# EAGLE design pectus (EAGLE 6.4)

## Sheet 1 of 2
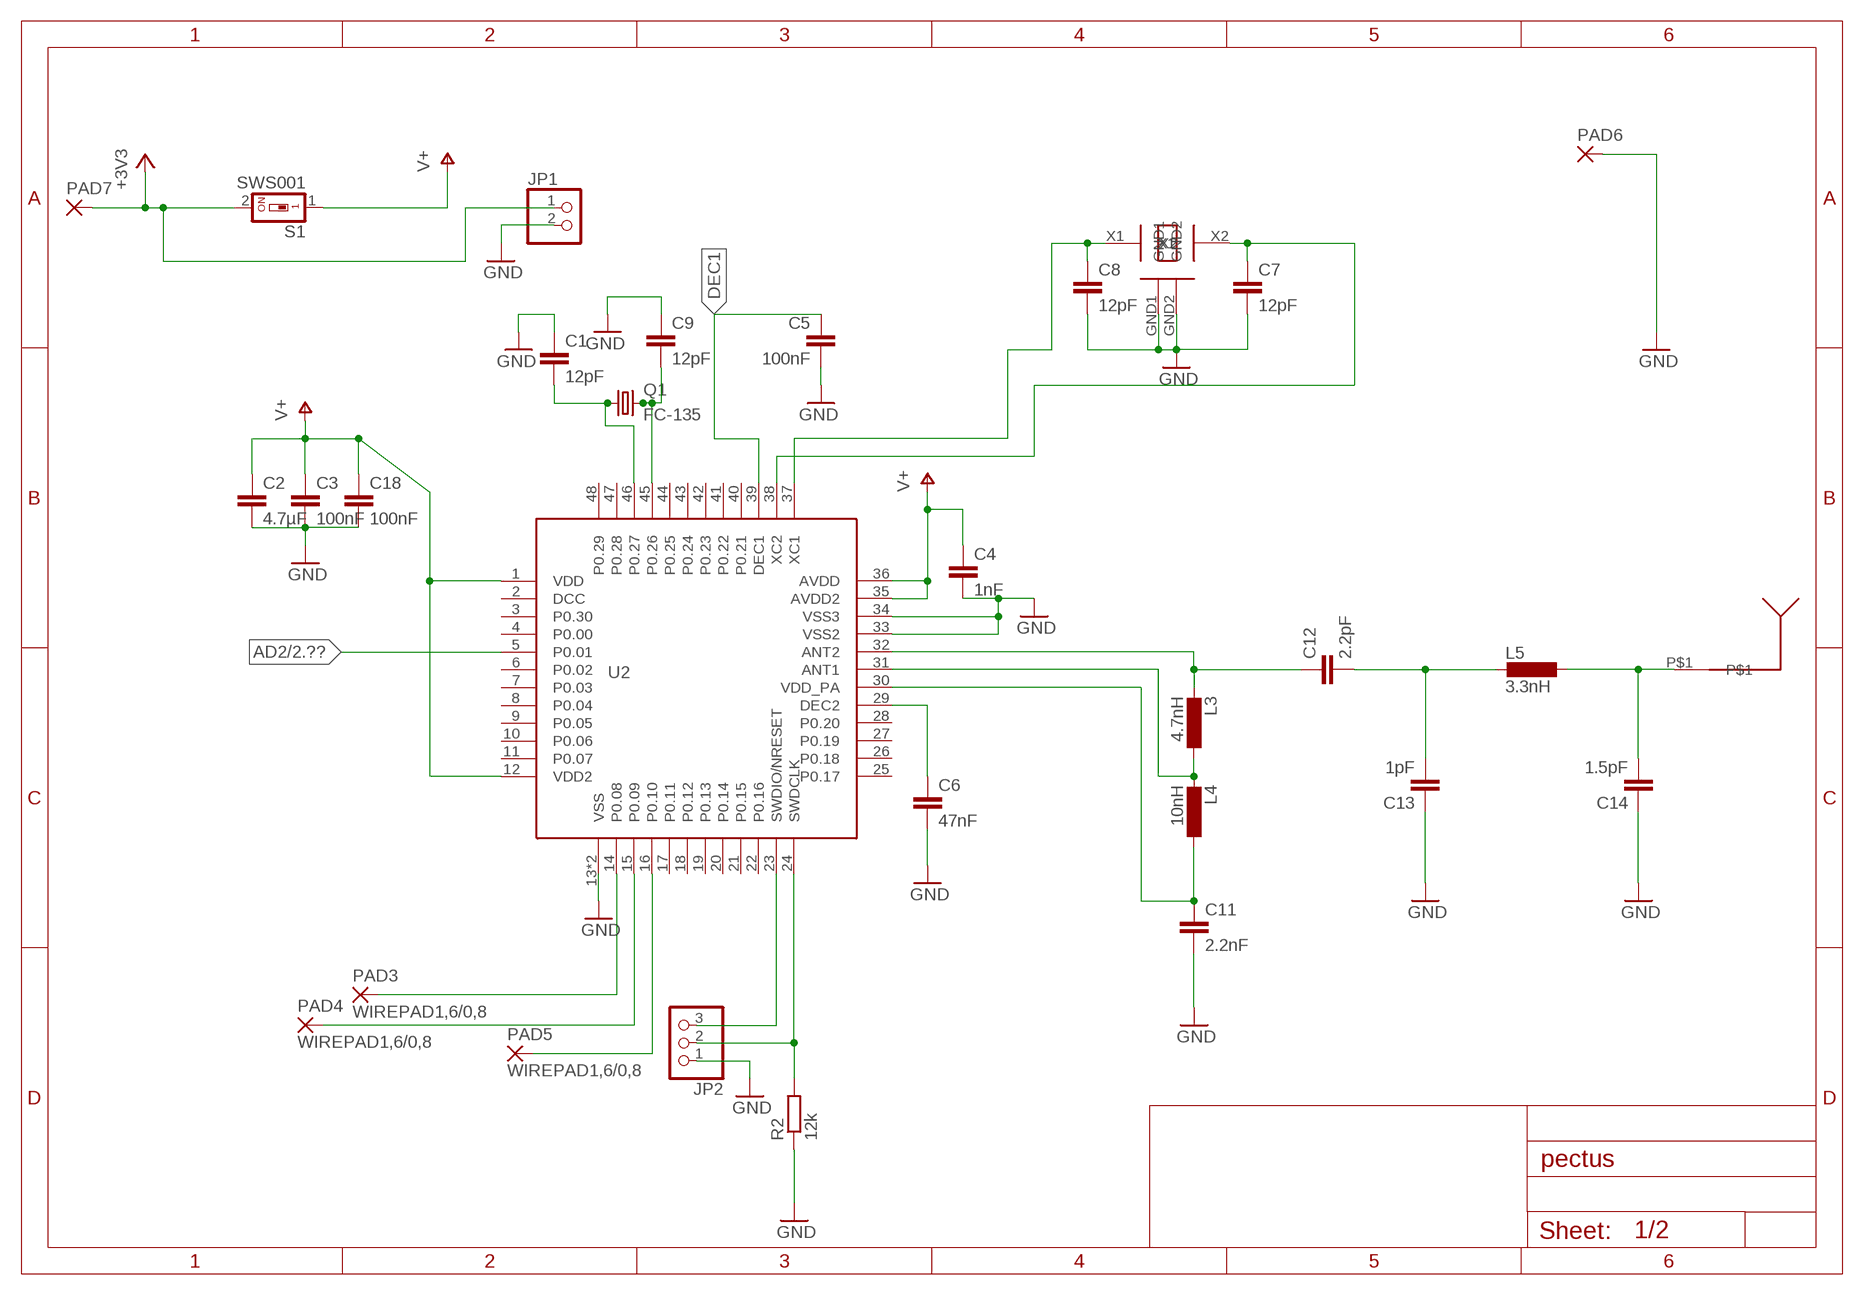
[diagram p0: schematic, sheet 1]

### Parts
C1  12pF  C-EUC0603K  [C0603K]
C2  4.7µF  C-EUC0603K  [C0603K]
C3  100nF  C-EUC0603K  [C0603K]
C4  1nF  C-EUC0603K  [C0603K]
C5  100nF  C-EUC0603K  [C0603K]
C6  47nF  C-EUC0603K  [C0603K]
C7  12pF  C-EUC0603K  [C0603K]
C8  12pF  C-EUC0603K  [C0603K]
C9  12pF  C-EUC0603K  [C0603K]
C11  2.2nF  C-EUC0603  [C0603]
C12  2.2pF  C-EUC0603  [C0603]
C13  1pF  C-EUC0603  [C0603]
C14  1.5pF  C-EUC0603  [C0603]
C18  100nF  C-EUC0603K  [C0603K]
JP1  PINHD-1X2  [1X02]
JP2  PINHD-1X3  [1X03]
L3  4.7nH  L-EUL0603  [R0603]
L4  10nH  L-EUL0603  [R0603]
L5  3.3nH  L-EUL0603  [R0603]
PAD3  WIREPAD1,6/0,8  [1,6/0,8]
PAD4  WIREPAD1,6/0,8  [1,6/0,8]
PAD5  WIREPAD1,6/0,8  [1,6/0,8]
PAD6  SMD5  [SMD2,54-5,08]
PAD7  SMD5  [SMD2,54-5,08]
Q1  FC-135  [FC-135]
R2  12k  R-EU_R0402  [R0402]
S1  SWS001  [SMS-001]
U2  NRF51822QFN  [QFN48(6X6)]
U$2  AVX16MHZOSCILLATOR  [AVX16MHZOSCILLATOR]
U$4  ANTENNA  [ANTENNA]

### Nets
+3V3: JP1.1 PAD7.1(P) S1.2
AD2: U2.5(P0.01) ; also sheet 2
DEC1: C5.1 U2.39(DEC1)
GND: C1.1 C2.2 C3.2 C4.2 C5.2 C6.2 C7.2 C8.2 C9.1 C11.2 C13.1 C14.1 C18.2 JP1.2 JP2.1 PAD6.1(P) R2.1 U2.13(VSS) U2.33(VSS2) U2.34(VSS3) U2.P$49(VSS) U$2.GND1 U$2.GND2 ; also sheet 2
N$1: C9.2 Q1.P$2 U2.45(P0.26)
N$2: C1.2 Q1.P$1 U2.46(P0.27)
N$3: PAD3.1(P) U2.14(P0.08)
N$4: PAD4.1(P) U2.15(P0.09)
N$5: PAD5.1(P) U2.16(P0.10)
N$7: C6.1 U2.29(DEC2)
N$8: JP2.3 U2.23(SWDIO/NRESET)
N$9: JP2.2 R2.2 U2.24(SWDCLK)
N$10: C8.1 U2.37(XC1) U$2.X1
N$11: C7.1 U2.38(XC2) U$2.X2
N$22: C11.1 L4.1 U2.30(VDD_PA)
N$23: L3.1 L4.2 U2.31(ANT1)
N$24: C12.1 L3.2 U2.32(ANT2)
N$25: C12.2 C13.2 L5.2
N$28: C14.2 L5.1 U$4.P$1
V+: C2.1 C3.1 C4.1 C18.1 S1.1 U2.1(VDD) U2.12(VDD2) U2.35(AVDD2) U2.36(AVDD) ; also sheet 2
Unconnected: U2.2(DCC) U2.3(P0.30) U2.4(P0.00) U2.6(P0.02) U2.7(P0.03) U2.8(P0.04) U2.9(P0.05) U2.10(P0.06) U2.11(P0.07) U2.17(P0.11) U2.18(P0.12) U2.19(P0.13) U2.20(P0.14) U2.21(P0.15) U2.22(P0.16) U2.25(P0.17) U2.26(P0.18) U2.27(P0.19) U2.28(P0.20) U2.40(P0.21) U2.41(P0.22) U2.42(P0.23) U2.43(P0.24) U2.44(P0.25) U2.47(P0.28) U2.48(P0.29)

## Sheet 2 of 2
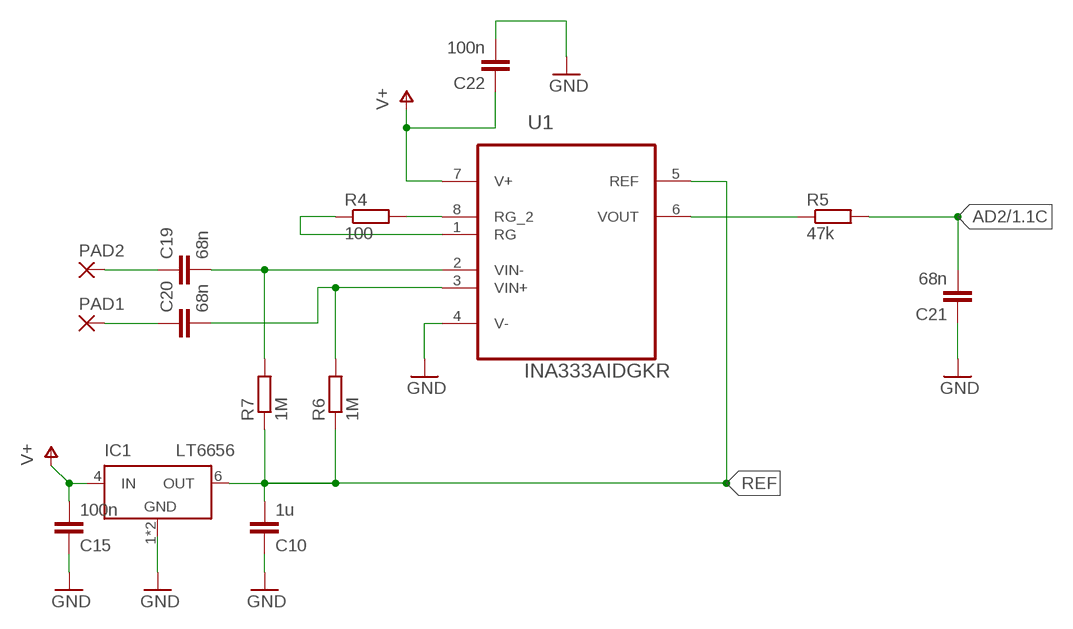
[diagram p1: schematic, sheet 2]

### Parts
C10  1u  C-EUC0603  [C0603]
C15  100n  C-EUC0603  [C0603]
C19  68n  C-EUC0603  [C0603]
C20  68n  C-EUC0603  [C0603]
C21  68n  C-EUC0603  [C0603]
C22  100n  C-EUC0603  [C0603]
IC1  LT6656  [TSOT23-6]
PAD1  1,6/0,8  [1,6/0,8]
PAD2  1,6/0,8  [1,6/0,8]
R4  100  R-EU_R0603  [R0603]
R5  47k  R-EU_R0603  [R0603]
R6  1M  R-EU_R0603  [R0603]
R7  1M  R-EU_R0603  [R0603]
U1  INA333AIDGKR  [SOP65P490X110-8N]

### Nets
AD2: C21.2 R5.2 ; also sheet 1
GND: C10.1 C15.1 C21.1 C22.2 IC1.1(GND) IC1.2(GND) U1.4(V-) ; also sheet 1
N$21: C19.1 PAD2.1(P)
N$26: R4.2 U1.8(RG_2)
N$27: C20.1 PAD1.1(P)
N$29: R4.1 U1.1(RG)
N$30: R5.1 U1.6(VOUT)
N$32: C19.2 R7.2 U1.2(VIN-)
N$33: C20.2 R6.2 U1.3(VIN+)
REF: C10.2 IC1.6(OUT) R6.1 R7.1 U1.5(REF)
V+: C15.2 C22.1 IC1.4(IN) U1.7(V+) ; also sheet 1

## Library data of the parts
C1-C15 C18-C22 = rcl:C-EU: CAPACITOR, European symbol
IC1 = LT6656:LT6656
JP1 = pinhead:PINHD-1X2: PIN HEADER
JP2 = pinhead:PINHD-1X3: PIN HEADER
L3-L5 = rcl2:L-EU: INDUCTOR, European symbol
PAD1 PAD2 = wirepad:1,6/0,8: THROUGH-HOLE PAD
PAD3-PAD5 = wirepad:WIREPAD: Wire PAD connect wire on PCB
PAD6 PAD7 = wirepad:SMD5: SMD PAD
Q1 = FC135:FC-135
R2 R4-R7 = rcl:R-EU_: RESISTOR, European symbol
S1 = smd-special:SWS001: SMD Dip Switch 1 pol.
U1 = Ina333:INA333AIDGKR: 0.05ìV/°C max, SINGLE-SUPPLY CMOS OPERATIONAL AMPLIFIERS Zer.-Drift Series; MPN: INA333AIDGKR; OC_FARNELL: 2295977; OC_NEWARK: 01P0907; PACKAGE: MSOP-8; SUPPLIER: Texas Instruments
U2 = nRF51822qfn:NRF51822QFN
U$2 = crystal:AVX16MHZOSCILLATOR
U$4 = nordicsemi:ANTENNA

## Board
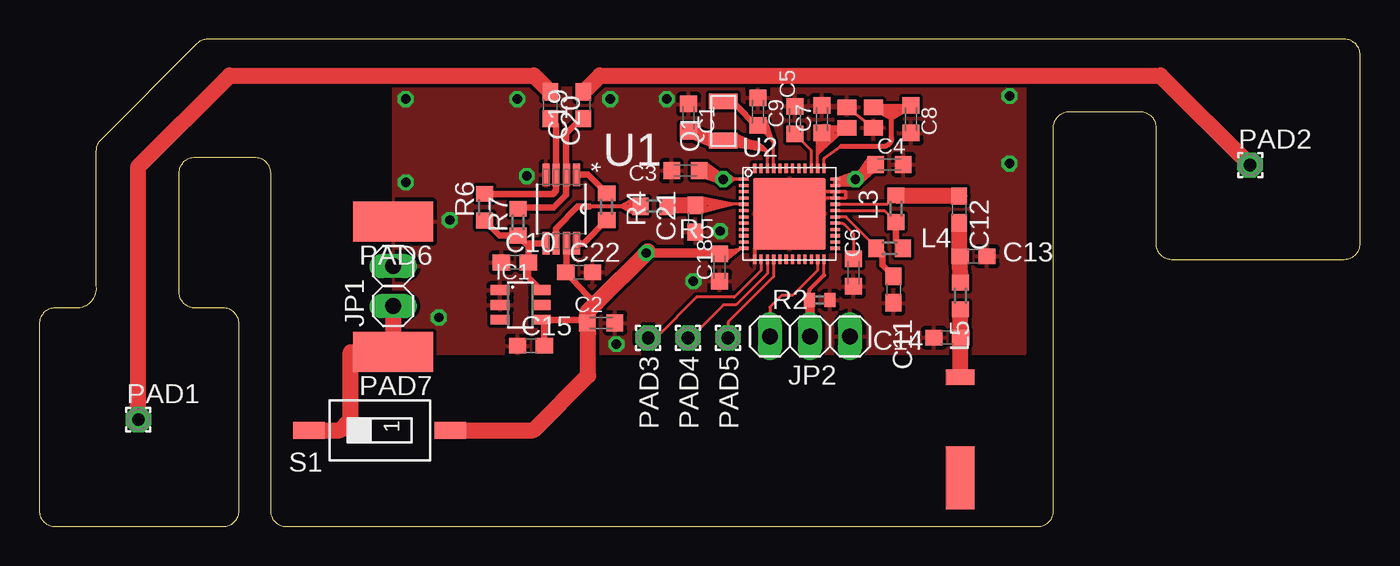
[diagram p2: board, top side]
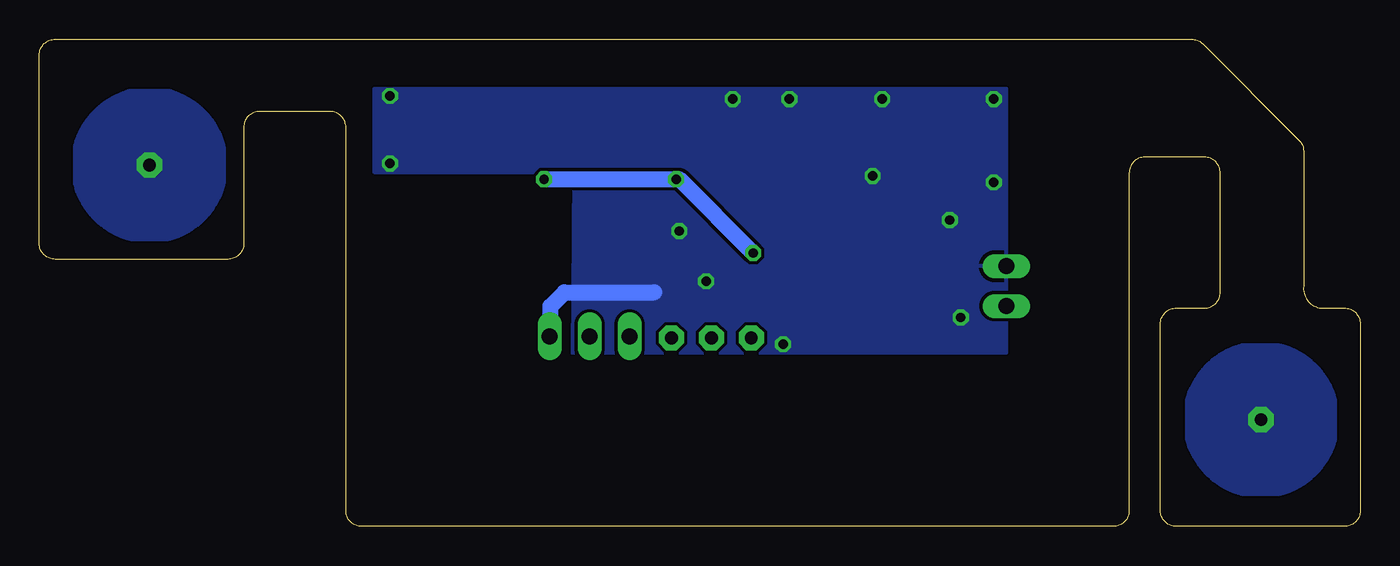
[diagram p3: board, bottom side, seen from below]

Size 84 x 31 mm. Coordinates in mm from the lower left corner, seen from the top.
Outline: 15.7,0 63.5,0 arc90 64.5,1 64.5,25.4 arc-90 65.5,26.4 70,26.4 arc-90 71,25.4 71,18 arc90 72,17 83,17 arc90 84,18 84,30 arc90 83,31 10.71,31 arc45 10.01,30.71 3.89,24.59 arc45 3.6,23.89 3.6,15.3 arc-90 2.5,13.9 1,13.9 arc90 0,12.9 0,1 arc90 1,0 11.7,0 arc90 12.7,1 12.7,12.9 arc90 11.7,13.9 9.9,13.9 arc-90 8.9,14.9 8.9,22.5 arc-90 9.9,23.5 13.7,23.5 arc-90 14.7,22.5 14.7,1 arc90 15.7,0
Copper layers (1*16): Top 0.035mm / dielectric 1.5mm / Bottom 0.035mm
Design rules "default *": minimum track width 0.15mm, minimum drill 0.6mm, track to track 0.2mm, track to pad 0.2mm, pad to pad 0.2mm, via to via 0.2mm, smd to smd 0.2mm, copper to edge 40mil, drill to drill 8mil, minimum pad ring 10mil, minimum via ring 8mil, stop-mask expansion 4mil, vias tented up to drill 0.6mm, thermal gap 10mil

### Footprints (pad centres in the part's own frame; a part is rotated, then mirrored left to right if it is on the bottom)
C0603K = smd 1.05 x 1.08: 1 -0.875,0; 2 0.875,0
C0603 = smd 1.1 x 1: 1 -0.85,0; 2 0.85,0
TSOT23-6 = smd 0.62 x 1.22: 1 -0.95,-1.3; 2 0,-1.3; 3 0.95,-1.3; 4 0.95,1.3; 5 0,1.3; 6 -0.95,1.3
1X02 = drill 1.016 long: 1 -1.27,0; 2 1.27,0
1X03 = drill 1.016 long: 1 -2.54,0; 2 0,0; 3 2.54,0
R0603 = smd 1 x 1.1: 1 -0.85,0; 2 0.85,0
1,6/0,8 = drill 0.813 pad 1.6 octagon: 1 0,0
SMD2,54-5,08 = smd 2.54 x 5.08: 1 0,0
FC-135 = smd 1 x 1.8: P$1 -1.25,0; P$2 1.25,0
R0402 = smd 0.7 x 0.9: 1 -0.65,0; 2 0.65,0
SMS-001 = smd 1.092 x 2.007: 1 0,-4.496; 2 0,4.496
SOP65P490X110-8N = smd 1.422 x 0.432: 1 -2.184,0.965; 2 -2.184,0.33; 3 -2.184,-0.33; 4 -2.184,-0.965; 5 2.184,-0.965; 6 2.184,-0.33; 7 2.184,0.33; 8 2.184,0.965
QFN48(6X6) = smd 0.6 x 0.2: 1 -2.9,2.2; 2 -2.9,1.8; 3 -2.9,1.4; 4 -2.9,1; 5 -2.9,0.6; 6 -2.9,0.2; 7 -2.9,-0.2; 8 -2.9,-0.6; 9 -2.9,-1; 10 -2.9,-1.4; 11 -2.9,-1.8; 12 -2.9,-2.2; 25 2.9,-2.2; 26 2.9,-1.8; 27 2.9,-1.4; 28 2.9,-1; 29 2.9,-0.6; 30 2.9,-0.2; 31 2.9,0.2; 32 2.9,0.6; 33 2.9,1; 34 2.9,1.4; 35 2.9,1.8; 36 2.9,2.2 | smd 0.2 x 0.6: 13 -2.2,-2.9; 14 -1.8,-2.9; 15 -1.4,-2.9; 16 -1,-2.9; 17 -0.6,-2.9; 18 -0.2,-2.9; 19 0.2,-2.9; 20 0.6,-2.9; 21 1,-2.9; 22 1.4,-2.9; 23 1.8,-2.9; 24 2.2,-2.9; 37 2.2,2.9; 38 1.8,2.9; 39 1.4,2.9; 40 1,2.9; 41 0.6,2.9; 42 0.2,2.9; 43 -0.2,2.9; 44 -0.6,2.9; 45 -1,2.9; 46 -1.4,2.9; 47 -1.8,2.9; 48 -2.2,2.9 | smd 4.6 x 4.6: P$49 0,0
AVX16MHZOSCILLATOR = smd 1.2 x 1: GND1 -0.6,0.5; GND2 1.1,-0.8; X1 1.1,0.5; X2 -0.6,-0.8
ANTENNA = smd 1 x 1.8: P$1 -0.5,0 | smd 4 x 1.8: P$2 5.9,0

### Placement (x,y rotation side)
C1  41.3,26 270 top
C2  35.73,12.96 0 top
C3  41.09,22.64 180 top
C4  54.07,23.04 0 top
C5  48.04,25.86 90 top
C6  51.76,16.15 270 top
C7  49.76,25.91 90 top
C8  55.44,25.91 270 top
C9  45.7,26.4 270 top
C10  30.24,16.8 0 top
C11  54.32,15.08 270 top
C12  58.5,20.17 270 top
C13  59.41,17.2 180 top
C14  57.74,12.02 0 top
C15  31.26,11.5 0 top
C18  43.26,16.49 270 top
C19  34.6,26.8 270 top
C20  32.5,26.8 270 top
C21  41.72,19.59 90 top
C22  34.33,16.18 0 top
IC1  30.6,14.1 270 top
JP1  22.5,15.3 90 top
JP2  49,12.1 180 top
L3  54.48,20.22 90 top
L4  54.07,17.7 0 top
L5  58.58,14.67 90 top
PAD1  6.3,6.8 0 top
PAD2  77,23 0 top
PAD3  38.72,12 0 top
PAD4  41.26,12 0 top
PAD5  43.8,12 0 top
PAD6  22.5,19.4 90 top
PAD7  22.5,11.1 90 top
Q1  43.5,25.8 90 top
R2  49.63,14.42 180 top
R4  36.08,20.35 270 top
R5  39.09,20.38 0 top
R6  28.32,20.31 90 top
R7  30.44,19.36 90 top
S1  21.65,6.12 90 top
U1  33.2,20.2 270 top
U2  47.7,19.9 0 top
U$2  51.95,26.17 0 top
U$4  58.57,9.01 270 top

### Tracks (layer width: path | path; a pad name or v marks a point on that pad's centre or on a via)
+3V3
  Top 1.016: S1.2 19.12,6.12 19.8,6.8 19.8,11.1 PAD7.1 JP1.1
AD2
  Top 0.2: U2.5 44.1,20.5 | 44.1,20.5 43.3,20.5 | 43.3,20.5 41.98,20.5 arc90 C21.2 41.72,20.18 arc90 42.1,20 44.1,20.5 | 44.1,20.5 42.2,20.9 42.2,20.8 | 42.2,20.8 42.2,20.2 43.5,20.4 43.3,20.5 | 43.3,20.5 42.2,20.8 | 42.2,20.8 42.4,20.6 | 42.4,20.6 42.3,20.3 43.3,20.5 | 43.3,20.5 42.4,20.6 | 42.4,20.6 42,20.3
  Top 0.406: R5.2 40.1,20.44
  Top 1.016: 40.1,20.44 C21.2
DEC1
  Top 0.2: U2.39 49.1,23.93 C5.1
GND  (via drill 0.6)
  Top 0.2: U$2.GND2 U$2.GND1 | U2.34 U2.33 | U2.34 46.5,21.3 45.5,20.3 U2.13 45.5,18.1 45.9,18.1 U2.P$49 | U2.33 51.3,20.9 51.3,21.3 U2.34 | U2.33 49.8,20.9
  Bottom 1.016: 51.5,11.9 51.5,14 50.6,14.9 44.9,14.9
  other vias: 26.1,19.5 41.6,15.6 43.3,18.8 36.3,27.2 39.9,27.2 36.7,11.6 23.3,21.9 23.3,27.2 61.7,27.4 61.7,23.1 30.4,27.2 25.4,13.3 31,22.3
  pour Top (isolate 0.2): 22.5,27.9 22.5,11 62.7,11 62.7,27.9
  pour Bottom: 62.7,22.5 62.7,27.9 22.5,27.9 22.5,11 50.1,11 50,22.5
N$1
  Top 0.2: U2.45 46.7,24.2 46.7,24.4 | 46.7,24.4 46.7,24.43 | 46.7,24.43 C9.2 45.88,25.23 | 44.05,27.05 Q1.P$2 | 46.7,24.43 46.2,25.9 46.3,24.9 46.4,25 46.7,24.4
  Top 0.406: 45.88,25.23 44.05,27.05
N$2
  Top 0.2: U2.46 46.3,23.4 | 46.3,23.9 46,24.2 45.98,24.2 | 45.98,24.2 44.1,24.2 | 44.1,24.2 44,24.2 43.65,24.55 Q1.P$1 42.72,24.55 | C1.2 41.88,24.55 42.72,24.55 | 46.3,23.9 44.1,24.2 | 44.1,24.2 44.32,24.94 45.98,24.2 | 45.98,24.2 46.08,24.02 44.3,24.4 44.4,24.7 45.5,24.3 44.4,24.5 45.2,24.5 arc-90 46.3,23.4 | 46.3,23.4 46.3,23.9 | 42.72,24.55 42.72,24.22 arc-90 42.7,24.2 41.5,24.7 41.7,25.3 42.8,24.9 42.6,24.4 42.4,24.4 41.8,24.8 41.8,24.9 | 41.8,24.9 41.8,25.2 42.7,24.8 42.8,24.5 41.8,24.9 | 41.8,24.9 41.9,25 42.8,24.7
N$3
  Top 0.2: U2.14 45.9,16.3 44.2,14.6 41.8,14.6 39.3,12.1 PAD3.1
N$4
  Top 0.2: U2.15 46.3,16.1 44.3,14.1 43.5,14.1 41.4,12 PAD4.1 41.6,12.3
N$5
  Top 0.2: U2.16 46.7,15.9 43.8,13 PAD5.1
N$7
  Top 0.2: U2.29 51.1,19.3 51.76,18.64 C6.1
N$8
  Top 0.2: U2.23 49.5,16.3 47.9,14.7 47.2,14.7 46.46,13.96 JP2.3
N$9
  Top 0.2: 49,14.24 R2.2 | 49.9,16 U2.24
  Top 0.254: R2.2 48.98,15.08 49.9,16
  Top 0.61: JP2.2 49,14.24
N$10
  Top 0.2: U2.37 49.9,23.4 51,24.2 | 53.6,26.7 54.2,26.7 54.28,26.78 | 53.6,26.7 53.08,26.7 U$2.X1 | C8.1 54.28,26.79 54.28,26.78 | 53.6,26.7 53.6,26.28 54.18,25.92 55.14,26.5 54.28,26.78 | 54.28,26.78 53.54,26.78 53.8,26.2 54.4,26.1 54.9,26.5 54.3,26.6 53.7,26.6 53.9,26.3 54.4,26.2 54.6,26.4 53.9,26.5 54.4,26.3 53.6,26.7
  Top 0.305: 51,24.2 53.7,24.2 arc90 54.2,24.7 54.2,26.7
N$11
  Top 0.2: U2.38 49.5,23.7 | 49.5,23.7 50.5,24.62 | 50.5,24.62 U$2.X2 51.28,25.43 49.8,25.43 | C7.1 49.8,25.43 | 49.8,25.43 50.02,25.11 | 50.02,25.11 50.5,24.73 | 50.5,24.73 50.5,24.62 | 50.5,24.73 50.5,25.4 50.7,25.4 50.7,24.8 50.4,25.1 50.4,25.3 50.3,25.2 50.4,24.8 | 50.4,24.8 50.2,25.2 50.2,25.4 50.1,25.5 49.8,25.5 49.8,25.4 49.82,25.42 49.82,25.44 | 49.5,23.7 51,25.3 50.1,25 49.8,24.2 50.2,24.8 | 50.4,24.8 50.2,24.8 | 50.2,24.8 49.5,23.7 | 50.02,25.11 49.5,23.7 | 49.5,23.7 49.5,24.5 49.6,24.2 49.6,24.6 49.5,23.7
N$21
  Top 1.016: PAD2.1 71.3,28.7 35.65,28.7 C19.1
  pour Bottom: 80.5,23 arc90 77,26.5 arc90 73.5,23 arc90 77,19.5 arc90
N$22
  Top 0.2: U2.30 51.3,19.7 53.02,17.98 L4.1 arc-90 53.62,17.4
  Top 0.406: 53.62,17.4 53.62,16.63 C11.1
N$23
  Top 0.2: U2.31 53.75,20.1 L3.1
  Top 0.406: L4.2 54.48,18.14 L3.1
N$24
  Top 0.2: U2.32 53.91,20.5 L3.2
  Top 1.016: 58.34,21 C12.1 58.5,21.07 L3.2
N$25
  Top 1.016: L5.2 58.54,17.16 C13.2 58.52,17.12 C12.2
N$26
  Top 0.2: 35.65,19.5 R4.2
  Top 0.406: U1.8 34.6,18.02 R4.2
N$27
  Top 1.016: PAD1.1 6.3,22.9 12.1,28.7 31.45,28.7 C20.1
  pour Bottom: 6.3,3.3 arc-90 2.8,6.8 arc-90 6.3,10.3 arc-90 9.8,6.8 arc-90
N$28
  Top 1.016: U$4.P$1 58.57,11.41 L5.1 C14.2
N$29
  Top 0.406: R4.1 34.9,22.38 U1.1
N$30
  Top 0.2: 34.98,20.36 38.14,20.36 R5.1 | R5.1 34.52,20.38 34.5,20.4 34.49,20.39 34.49,20.38 | R5.1 37.8,20.82 37,20.4 37.78,19.92 37.7,20.7 37.4,20.4 37.7,20.1 38.3,20.4 38.2,20.4
  Top 0.406: U1.6 32.87,18.97 34.24,20.36 34.98,20.36
N$32
  Top 0.406: R7.2 arc-90 30.63,20.3 32.7,20.3 33.5,21.1 33.5,22.35 U1.2 33.5,22.41 33.5,25 34.45,25.95 C19.2
N$33
  Top 0.2: 32.87,25.58 C20.2
  Top 0.406: 32.87,25.58 U1.3 32.87,21.37 32.66,21.16 R6.2
REF
  Top 0.406: R6.1 29.27,18.51 R7.1 30.93,18.02 31.1,18.02 | 31.1,18.02 U1.5 | 31.1,18.02 C10.2 31.09,15.86 IC1.6
V+  (via drill 0.6)
  Top 0.2: v43.5,22.1 44.2,22.09 44.41,22.1 U2.1 44.2,22.1 | C18.1 43.17,17.4 44.6,17.7 | 44.6,17.7 U2.12 | U2.35 U2.36 | U2.36 v51.9,22.1 | C4.1 53.16,23.1 arc60 52.8,23.5 52.1,22.5 52.3,21.9 53.1,22.6 52.7,23.1 52.2,22.4 52.9,23 53.2,23.1 | 43.4,22.14 43.4,22.3 | 44.6,17.7 43.7,17 43.7,17.2 | 43.7,17.2 43.7,17.6 44.4,17.6 43.7,17.2 | 43.7,17.2 43.8,17.5 44,17.5 44.6,17.7 | U2.36 51.7,22.5 51.7,21.7 50.7,21.7 50.7,22 51.6,22.3 51.6,21.8 50.8,21.8 50.8,22 51.5,21.9 U2.36 | 44.2,22.1 43.7,22.5 43.7,21.7 44.2,22.1 | C22.1 33.53,16.21 | 42.24,22.54 42.38,22.2 43.6,21.8 43.3,22.5 42.46,23.08 42.5,22.7 43.2,22.4 42.5,22.9 42.24,22.54
  Top 0.406: 43.4,22.14 v43.5,22.1 v43.49,22.1 42.24,22.54 C3.1 | v51.9,22.1 52.26,22.1 C4.1 | 33.53,16.21 U1.7 | C22.1 35.25,14.29 35.45,14.25 | C15.2 32.1,13.2 IC1.4 35.16,13.15 34.86,13.55
  Top 0.61: 43.17,17.4 v38.6,17.4
  Top 1.016: S1.1 31.42,6.12 34.9,9.6 34.9,12.29 C2.1 34.86,13.55 34.84,13.64 35.45,14.25 v38.6,17.4 38.7,17.52
  Bottom 1.016: v51.9,22.1 v43.5,22.1 43.3,22.1 v38.6,17.4